# Altium schematic sheet MECHANICAL.SchDoc: MECHANICAL
size A4; Date: Not used; ApprovedBy: Not used; CheckedBy: Not used; Author: Not used; CompanyName: STMicroelectronics; DrawnBy: Not used; Engineer: Not used; Organization: Not used; Address1: Not used; Address2: Not used; Address3: Not used; Address4: Not used; DocumentNumber: Not used; Revision: Not used; SheetNumber: 16; SheetTotal: 16; CurrentTime: Not used; CurrentDate: Not used; Time: Not used; DocumentFullPathAndName: Not used; DocumentName: Not used; ModifiedDate: Not used; ImagePath: Not used; ProjectName: Not used; Application_BuildNumber: Not used
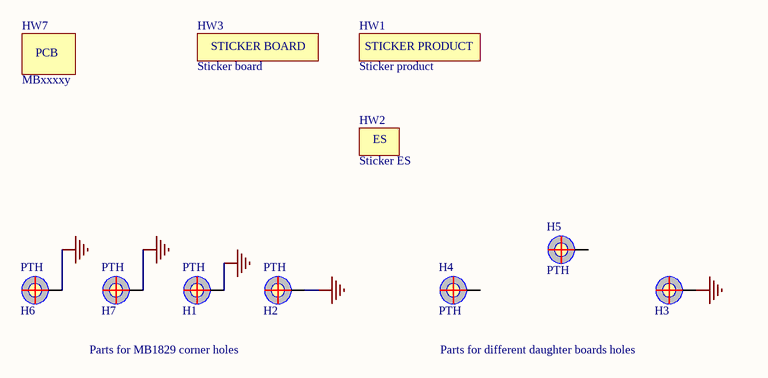
[diagram p0: MECHANICAL.SchDoc]

## Parts
H1  value PTH  [PTH_350_700_H-12]  (hidden comment: POSITION HOLE)  (no BOM)
H2  value PTH  [PTH_350_700_H-12]  (hidden comment: POSITION HOLE)  (no BOM)
H3  POSITION HOLE  [PTH_450_900]  (value not drawn)  (no BOM)
H4  value PTH  [PTH_350_500]  (hidden comment: POSITION HOLE)  (no BOM)
H5  value PTH  [PTH_350_500]  (hidden comment: POSITION HOLE)  (no BOM)
H6  value PTH  [PTH_350_700_H-12]  (hidden comment: POSITION HOLE)  (no BOM)
H7  value PTH  [PTH_350_700_H-12]  (hidden comment: POSITION HOLE)  (no BOM)
HW1  value Sticker product  [STICKER_PRODUCT_25X5]  (hidden comment: STICKER_PRODUCT)  (no BOM)
HW2  value Sticker ES  [STICKER_ES_6X6]  (hidden comment: STICKER_ES)  (no BOM)
HW3  value Sticker board  [STICKER_BOARD_25X9]  (hidden comment: STICKER_BOARD)  (no BOM)
HW7  value MBxxxxy  (hidden comment: PCB)  (no BOM)

## Nets
GND: H1.1 H2.1 H3.1 H6.1 H7.1

Not connected (* = marked no-connect by the designer): H4 1; H5 1

## Notes on the sheet
- Parts for MB1829 corner holes
- Parts for different daughter boards holes
- Title:
- Project:
- Size:
- Revision:
- Variant:
- A4
- -
- Date:
- Reference:
- Sheet:
- of
- (in symbol MCD-00234) ES
- (in symbol MCD-00235) STICKER BOARD
- (in symbol MCD-02189) STICKER PRODUCT

## Library data of the parts
H1 H2 H6 H7 = MCD-02916: Position hole,  C7D3R5 with 12mm M3 pillar on bottom; Part_Type: Misc; Part_Preference: Recommended; ShowFields: YES; ID: 5032; Internal_Part_Number: MCD-02916; Status: Checked; Manufacturer: N/A; Manufacturer_Part_Number: N/A; Order_Code_Digikey: N/A; Order_Code_Farnell: N/A; Order_Code_RS: N/A; ComponentLink1URL: http://tunmcdsvn.tun.st.com/Component_Documentation_Library/Trunk
H3 = MCD-01612: POSITION HOLE C9D4R5; Part_Type: Misc; Part_Preference: Recommended; ShowFields: YES; ID: 3712; Internal_Part_Number: MCD-01612; Status: New; Manufacturer: N/A; Manufacturer_Part_Number: N/A; Order_Code_Digikey: N/A; Order_Code_Farnell: N/A; Order_Code_RS: N/A
H4 H5 = MCD-02915: Position Hole C5D3R5: with no pillar in 3D, with pad design = c500h350m510.; Part_Type: Misc; Part_Preference: Recommended; ShowFields: YES; ID: 5031; Internal_Part_Number: MCD-02915; Status: Checked; Manufacturer: N/A; Manufacturer_Part_Number: N/A; Order_Code_Digikey: N/A; Order_Code_Farnell: N/A; Order_Code_RS: N/A; ComponentLink1URL: http://tunmcdsvn.tun.st.com/Component_Documentation_Library/Trunk
HW1 = MCD-02189: Sticker product 25x5 mm; Part_Preference: Recommended; Part_Type: Misc; Internal_Part_Number: MCD-02189; Status: Released; Manufacturer: N/A; Manufacturer_Part_Number: N/A; ComponentLink1URL: N/A; Order_Code_Digikey: N/A; Order_Code_Farnell: N/A; Order_Code_RS: N/A
HW2 = MCD-00234: Sticker ES 6x6 mm; Part_Type: Misc; Part_Preference: Recommended; Internal_Part_Number: MCD-00234; Status: Released; Manufacturer_Part_Number: N/A; Manufacturer: N/A; ComponentLink1URL: N/A; Order_Code_Digikey: N/A; Order_Code_Farnell: N/A; Order_Code_RS: N/A
HW3 = MCD-00235: Sticker Board 25x9 mm; Part_Preference: Recommended; Part_Type: Misc; Internal_Part_Number: MCD-00235; Status: Released; Manufacturer: N/A; Manufacturer_Part_Number: N/A; ComponentLink1URL: N/A; Order_Code_Digikey: N/A; Order_Code_Farnell: N/A; Order_Code_RS: N/A
HW7 = MCD-00216: PCB, xxxx for PCB number, Y for PCB revision; Part_Type: Misc; Part_Preference: Forbidden; ShowFields: YES; ID: 2653; Internal_Part_Number: MCD-00216; Status: Released; Manufacturer_Part_Number: n/a; Manufacturer: N/A